# EAGLE design microLift (EAGLE 7.2.0)
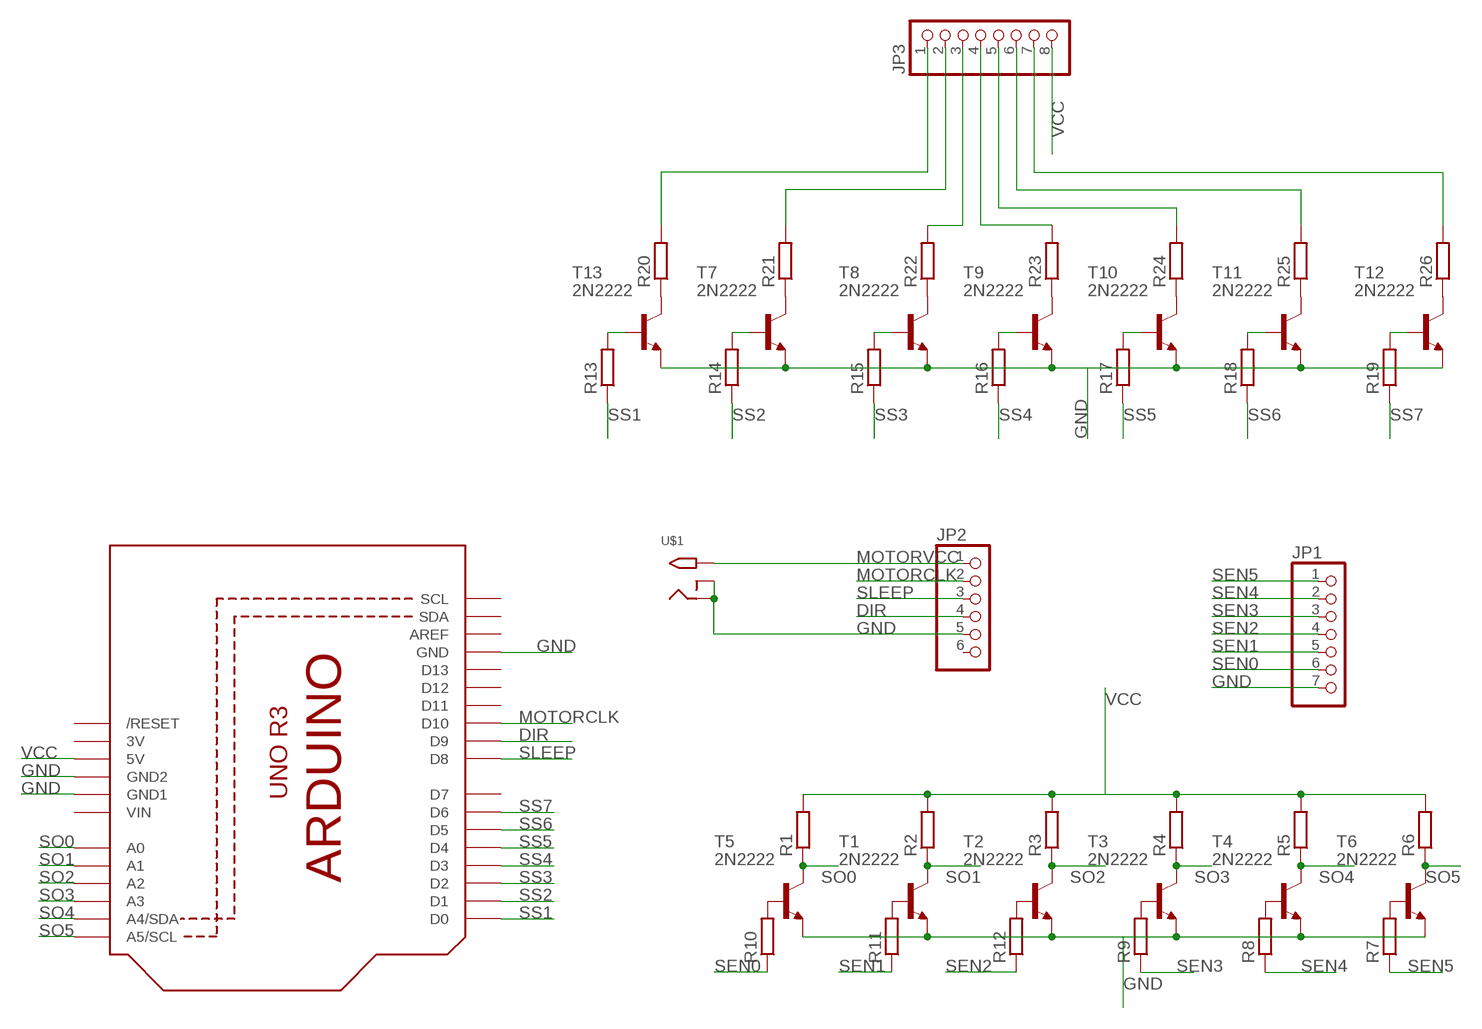
[diagram p0: schematic, sheet 1]

## Parts
JP1  PINHD-1X7  [1X07]
JP2  PINHD-1X6  [1X06]
JP3  PINHD-1X8BIG  [1X08-BIG]
Q1  ARDUINOR3-NOIOREF-NOTEXT  [ARDUINOR3-NOTEXT-NOIOREF]
R1  R-EU_0204/7  [0204/7]
R2  R-EU_0204/7  [0204/7]
R3  R-EU_0204/7  [0204/7]
R4  R-EU_0204/7  [0204/7]
R5  R-EU_0204/7  [0204/7]
R6  R-EU_0204/7  [0204/7]
R7  R-EU_0204/7  [0204/7]
R8  R-EU_0204/7  [0204/7]
R9  R-EU_0204/7  [0204/7]
R10  R-EU_0204/7  [0204/7]
R11  R-EU_0204/7  [0204/7]
R12  R-EU_0204/7  [0204/7]
R13  R-EU_0204/7  [0204/7]
R14  R-EU_0204/7  [0204/7]
R15  R-EU_0204/7  [0204/7]
R16  R-EU_0204/7  [0204/7]
R17  R-EU_0204/7  [0204/7]
R18  R-EU_0204/7  [0204/7]
R19  R-EU_0204/7  [0204/7]
R20  R-EU_0204/7  [0204/7]
R21  R-EU_0204/7  [0204/7]
R22  R-EU_0204/7  [0204/7]
R23  R-EU_0204/7  [0204/7]
R24  R-EU_0204/7  [0204/7]
R25  R-EU_0204/7  [0204/7]
R26  R-EU_0204/7  [0204/7]
T1  2N2222  [TO92-EBC-OVAL]
T2  2N2222  [TO92-EBC-OVAL]
T3  2N2222  [TO92-EBC-OVAL]
T4  2N2222  [TO92-EBC-OVAL]
T5  2N2222  [TO92-EBC-OVAL]
T6  2N2222  [TO92-EBC-OVAL]
T7  2N2222  [TO92-EBC-OVAL]
T8  2N2222  [TO92-EBC-OVAL]
T9  2N2222  [TO92-EBC-OVAL]
T10  2N2222  [TO92-EBC-OVAL]
T11  2N2222  [TO92-EBC-OVAL]
T12  2N2222  [TO92-EBC-OVAL]
T13  2N2222  [TO92-EBC-OVAL]
U$1  2.1MMJACKTHM  [PJ-102A]

## Nets
DIR: JP2.4 Q1.D9
GND: JP1.7 JP2.5 Q1.GND Q1.GND1 Q1.GND2 T1.E T2.E T3.E T4.E T5.E T6.E T7.E T8.E T9.E T10.E T11.E T12.E T13.E U$1.RING U$1.RING_SW
MOTORCLK: JP2.2 Q1.D10
MOTORVCC: JP2.1 U$1.TIP
N$1: R7.2 T6.B
N$2: R8.2 T4.B
N$3: R9.2 T3.B
N$4: R10.2 T5.B
N$5: R11.2 T1.B
N$6: R12.2 T2.B
N$7: R13.2 T13.B
N$8: R14.2 T7.B
N$9: R15.2 T8.B
N$10: R16.2 T9.B
N$11: R17.2 T10.B
N$12: R18.2 T11.B
N$13: R19.2 T12.B
N$14: R20.1 T13.C
N$15: R22.1 T8.C
N$16: R23.1 T9.C
N$17: R25.1 T11.C
N$18: R26.1 T12.C
N$19: R21.1 T7.C
N$20: R24.1 T10.C
N$21: JP3.4 R23.2
N$22: JP3.3 R22.2
N$23: JP3.2 R21.2
N$24: JP3.1 R20.2
N$25: JP3.5 R24.2
N$26: JP3.6 R25.2
N$27: JP3.7 R26.2
SEN0: JP1.6 R10.1
SEN1: JP1.5 R11.1
SEN2: JP1.4 R12.1
SEN3: JP1.3 R9.1
SEN4: JP1.2 R8.1
SEN5: JP1.1 R7.1
SLEEP: JP2.3 Q1.D8
SO0: Q1.A0 R1.1 T5.C
SO1: Q1.A1 R2.1 T1.C
SO2: Q1.A2 R3.1 T2.C
SO3: Q1.A3 R4.1 T3.C
SO4: Q1.A4(A4/SDA) R5.1 T4.C
SO5: Q1.A5(A5/SCL) R6.1 T6.C
SS1: Q1.D0 R13.1
SS2: Q1.D1 R14.1
SS3: Q1.D2 R15.1
SS4: Q1.D3 R16.1
SS5: Q1.D4 R17.1
SS6: Q1.D5 R18.1
SS7: Q1.D6 R19.1
VCC: JP3.8 Q1.5V R1.2 R2.2 R3.2 R4.2 R5.2 R6.2
Unconnected: JP2.6 Q1.AREF Q1.D7 Q1.D11 Q1.D12 Q1.D13 Q1.RESET(/RESET) Q1.SCL Q1.SDA

## Power pins joined to a net without a drawn wire
3V: Q1.3V
VIN: Q1.VIN

## Library data of the parts
JP1 = pinhead:PINHD-1X7: PIN HEADER
JP2 = adafruit:PINHD-1X6: PIN HEADER
JP3 = adafruit:PINHD-1X8: PIN HEADER
Q1 = adafruit:ARDUINOR3-NOIOREF
R1-R6 R13-R26 = rcl:R-EU_: RESISTOR, European symbol
R7-R12 = resistor:R-EU_: RESISTOR, European symbol
T1-T13 = adafruit:2N2222: NPN TRANSISTOR Big oval pads
U$1 = adafruit:2.1MMJACK: 2.1mm x 5.5mm THM DC jack with internal switch. Digikey part #PJ-102A, 4UCON part #05537 2.1mm x 5.5mm SMT DC jack with internal switch. Digikey part #PJ-002A-SMT, 4UCON part #03267 By microbuilder.eu & adafruit.com

## Board
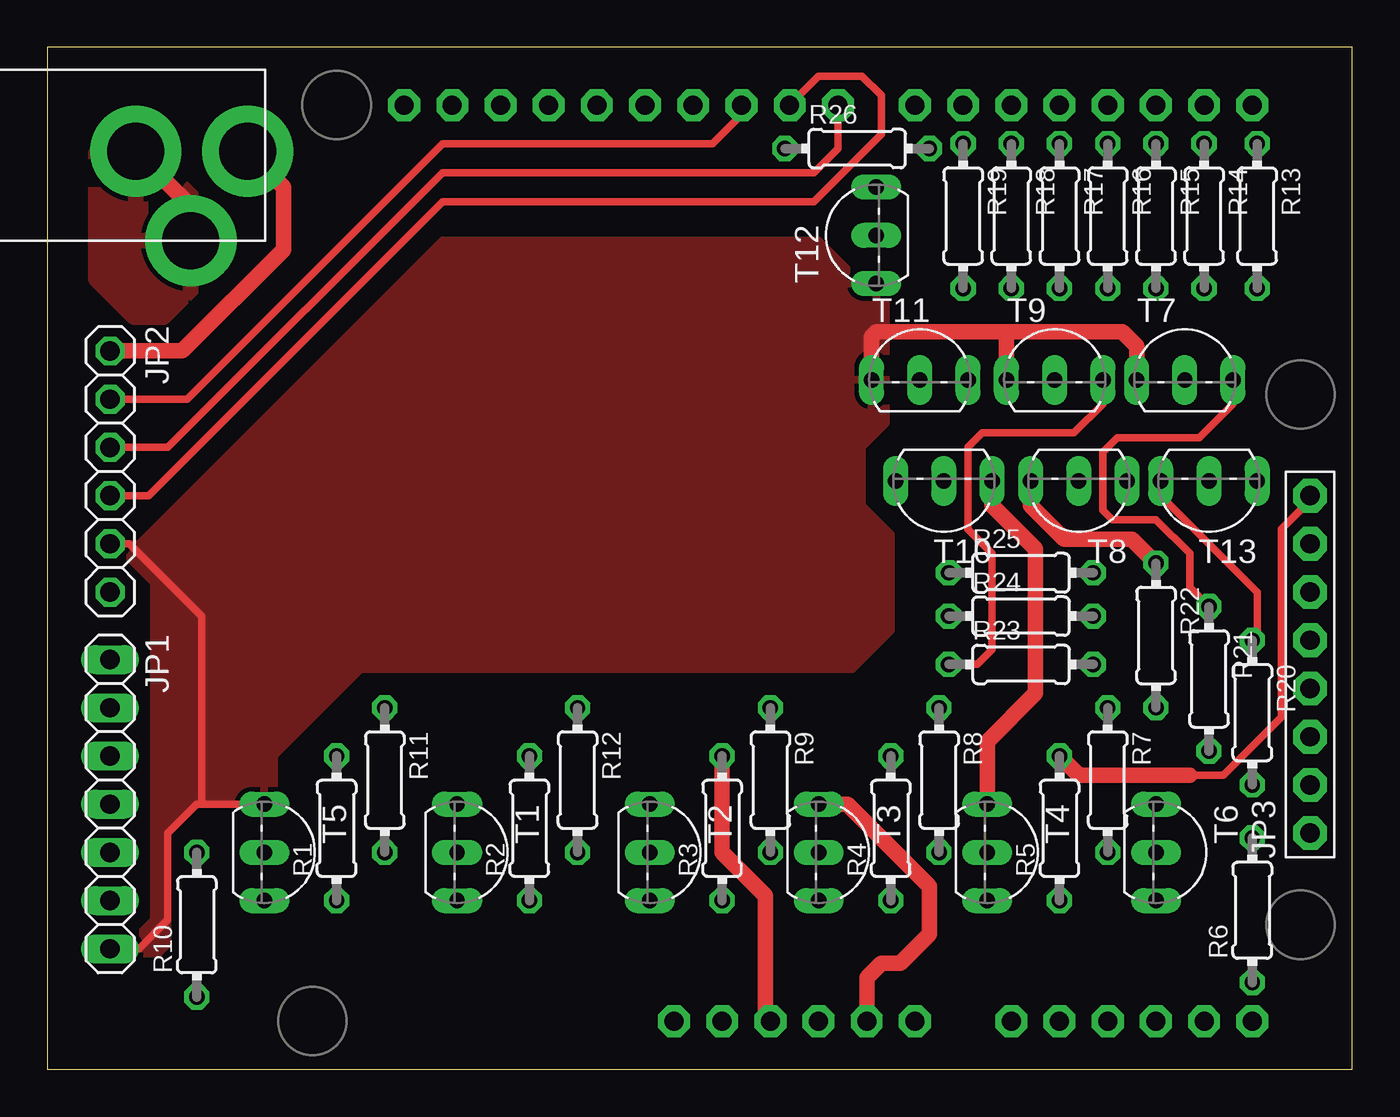
[diagram p1: board, top side]
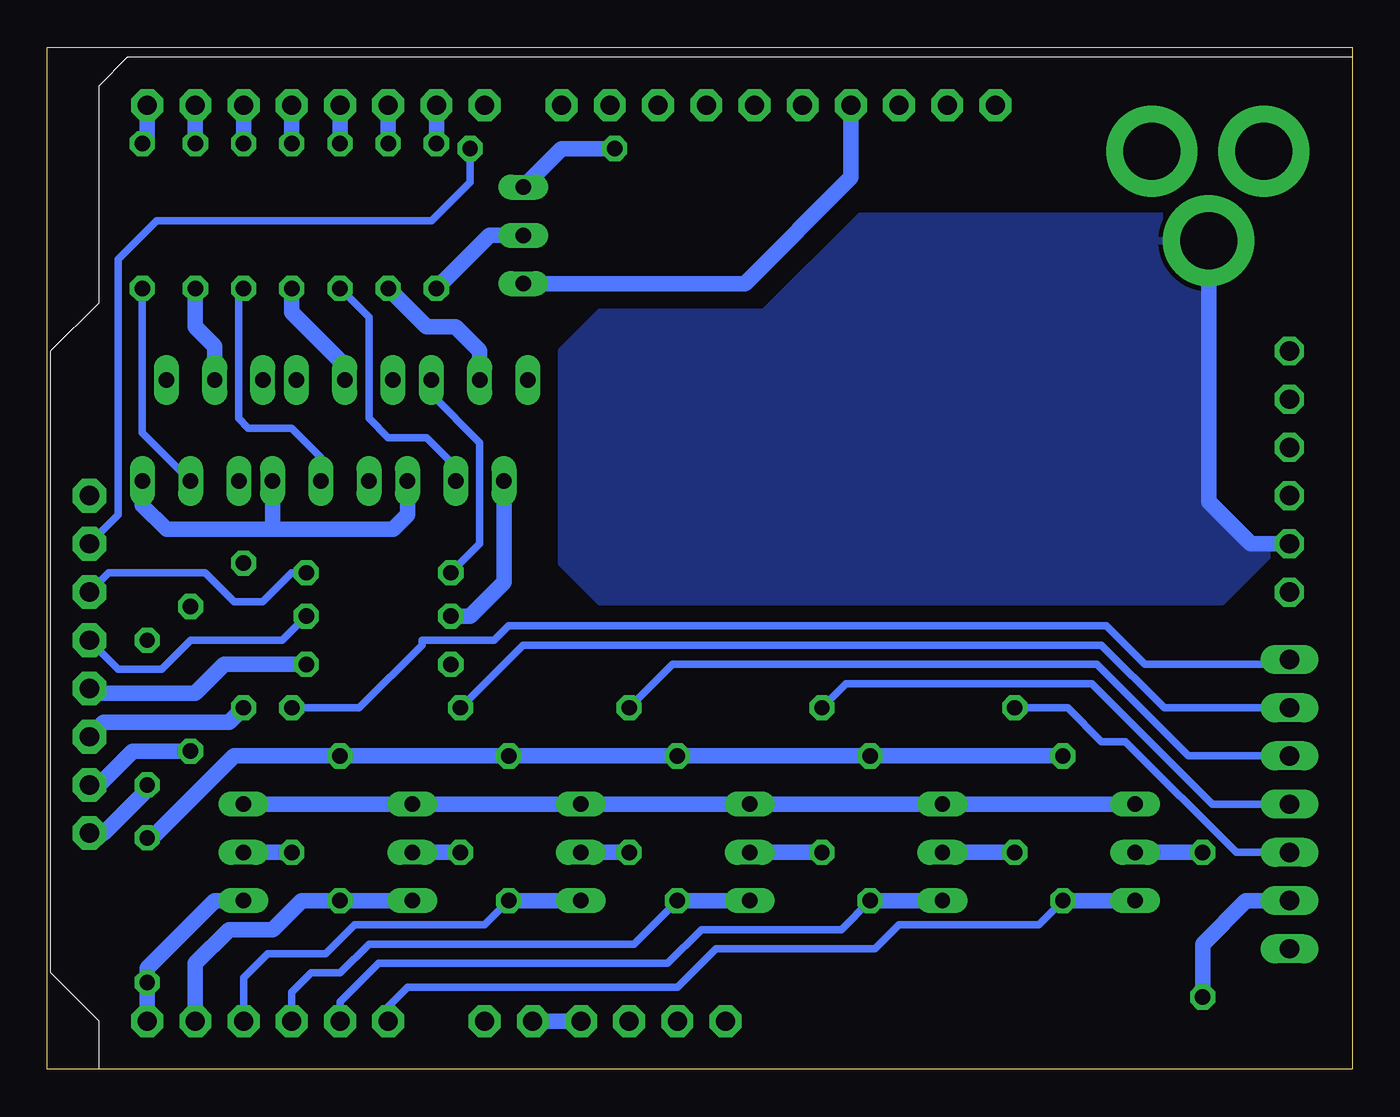
[diagram p2: board, bottom side, seen from below]

Size 68.76 x 53.84 mm. Coordinates in mm from the lower left corner, seen from the top.
Outline: 0,0 68.76,0 68.76,53.84 0,53.84 0,0
Copper layers (1*16): Top 0.035mm / dielectric 1.5mm / Bottom 0.035mm
Design rules "default": minimum track width 10mil, minimum drill 24mil, track to track 8mil, track to pad 8mil, pad to pad 8mil, via to via 8mil, smd to smd 8mil, copper to edge 40mil, drill to drill 8mil, minimum pad ring 10mil, minimum via ring 8mil, stop-mask expansion 4mil, vias tented up to drill 0mil, thermal gap 10mil

### Footprints (pad centres in the part's own frame; a part is rotated, then mirrored left to right if it is on the bottom)
1X07 = drill 1.016 long: 1 -7.62,0; 2 -5.08,0; 3 -2.54,0; 4 0,0; 5 2.54,0; 6 5.08,0; 7 7.62,0
1X06 = drill 1.016 octagon: 1 -6.35,0; 2 -3.81,0; 3 -1.27,0; 4 1.27,0; 5 3.81,0; 6 6.35,0
1X08-BIG = drill 1.016 pad 1.778 octagon: 1 -8.89,0; 2 -6.35,0; 3 -3.81,0; 4 -1.27,0; 5 1.27,0; 6 3.81,0; 7 6.35,0; 8 8.89,0
ARDUINOR3-NOTEXT-NOIOREF = drill 1 pad 1.676 octagon: 3V 35.56,2.54; 5V 38.1,2.54; A0 50.8,2.54; A1 53.34,2.54; A2 55.88,2.54; A3 58.42,2.54; A4 60.96,2.54; A5 63.5,2.54; AREF 23.876,50.8; D0 63.5,50.8; D1 60.96,50.8; D2 58.42,50.8; D3 55.88,50.8; D4 53.34,50.8; D5 50.8,50.8; D6 48.26,50.8; D7 45.72,50.8; D8 41.656,50.8; D9 39.116,50.8; D10 36.576,50.8; D11 34.036,50.8; D12 31.496,50.8; D13 28.956,50.8; GND 26.416,50.8; GND1 43.18,2.54; GND2 40.64,2.54; RESET 33.02,2.54; SCL 18.796,50.8; SDA 21.336,50.8; VIN 45.72,2.54
0204/7 = drill 0.813 octagon: 1 -3.81,0; 2 3.81,0
TO92-EBC-OVAL = drill 0.813 long: B 0,-1.27; C 2.54,-1.27; E -2.54,-1.27
PJ-102A = drill 3 pad 4.8: RING 0.1,-3.39; RING_SW -4.6,-6.29; TIP 0.1,-9.29

### Placement (x,y rotation side)
JP1  3.3,13.97 270 top
JP2  3.3,31.5 270 top
JP3  66.55,21.34 90 top
Q1  0,0 0 top
R1  15.24,12.7 90 top
R2  25.4,12.7 90 top
R3  35.56,12.7 90 top
R4  44.45,12.7 90 top
R5  53.34,12.7 90 top
R6  63.5,8.38 90 top
R7  55.88,15.24 270 top
R8  46.99,15.24 270 top
R9  38.1,15.24 270 top
R10  7.87,7.62 90 top
R11  17.78,15.24 270 top
R12  27.94,15.24 270 top
R13  63.75,44.96 270 top
R14  60.96,44.96 270 top
R15  58.42,44.96 270 top
R16  55.88,44.96 270 top
R17  53.34,44.96 270 top
R18  50.8,44.96 270 top
R19  48.26,44.96 270 top
R20  63.5,18.8 270 top
R21  61.21,20.57 270 top
R22  58.42,22.86 270 top
R23  51.31,21.34 0 top
R24  51.31,23.88 0 top
R25  51.31,26.16 0 top
R26  42.67,48.51 0 top
T1  22.86,11.43 270 top
T2  33.02,11.43 270 top
T3  41.91,11.43 270 top
T4  50.8,11.43 270 top
T5  12.7,11.43 270 top
T6  59.69,11.43 270 top
T7  59.94,37.59 0 top
T8  54.36,29.72 180 top
T9  53.09,37.59 0 top
T10  47.24,29.72 180 top
T11  45.97,37.59 0 top
T12  42.42,43.94 90 top
T13  61.21,29.72 180 top
U$1  1.27,48.26 90 top

### Tracks (layer width: path | path; a pad name or v marks a point on that pad's centre or on a via)
DIR
  Top 0.406: Q1.D9 40.64,52.32 42.93,52.32 43.94,51.31 43.94,49.28 40.39,45.72 20.83,45.72 5.33,30.23 JP2.4
GND
  Top 0.406: JP1.7 4.83,6.35 6.35,7.87 6.35,12.45 7.87,13.97 8.13,13.97 | 8.13,13.97 T5.E | JP2.5 4.32,27.69 8.13,23.88 8.13,13.97
  Top 0.813: T4.E 49.53,17.27 52.07,19.81 52.07,27.43 49.78,29.72 T10.E | U$1.RING_SW 7.56,45.46 U$1.RING | T3.E 42.16,13.97 46.48,9.65 46.48,7.11 44.96,5.59 43.94,5.59 43.18,4.83 Q1.GND1 | T7.E 57.4,38.1 56.64,38.86 50.55,38.86 | 50.55,38.86 43.69,38.86 43.43,38.61 T11.E | T9.E 50.55,38.86
  Bottom 0.813: T6.E T4.E T3.E T2.E T1.E T5.E | T12.E 32,41.4 26.42,46.99 Q1.GND | U$1.RING_SW 7.56,29.91 5.33,27.69 JP2.5 | Q1.GND2 Q1.GND1 | T13.E 63.75,29.72 62.48,28.45 57.15,28.45 | 57.15,28.45 50.55,28.45 49.78,29.21 T10.E | T8.E 56.9,28.7 57.15,28.45
  pour Bottom: 3.56,27.69 5.59,27.69 7.62,29.72 7.62,43.69 7.87,43.94 7.87,44.2 8.64,44.96 25.91,44.96 30.99,39.88 39.62,39.88 41.66,37.85 41.66,26.67 39.62,24.64 6.86,24.64 4.32,27.18 3.56,27.18 3.3,27.43
  pour Top: 3.3,27.69 4.83,27.69 20.83,43.69 40.64,43.69 42.93,41.4 44.2,41.4 44.2,34.04 42.93,32.77 42.93,29.72 44.45,28.19 44.45,23.11 42.42,21.08 16.51,21.08 11.94,16.51 11.94,13.97 8.89,13.97 6.6,16.26 6.6,24.64 3.81,27.43 3.3,27.43
  pour Top: 3.56,6.6 4.32,6.6 5.59,7.87 5.59,27.69 6.1,27.69 8.38,25.4 8.38,14.48 6.35,12.45 6.35,6.6 5.84,6.1 4.06,6.1
  pour Top: 4.57,48.26 2.54,48.26 2.54,41.66 4.57,39.62 6.1,39.62 7.87,41.4 7.87,45.47 7.87,45.72 5.33,48.26
MOTORCLK
  Top 0.406: Q1.D10 36.58,50.29 35.05,48.77 20.83,48.77 7.37,35.31 JP2.2
MOTORVCC
  Top 0.813: JP2.1 7.11,37.85 12.45,43.18 12.45,46.47 U$1.TIP
N$1
  Bottom 0.813: T6.B R7.2
N$2
  Bottom 0.813: T4.B R8.2
N$3
  Bottom 0.813: T3.B R9.2
N$4
  Bottom 0.813: T5.B R10.2
N$5
  Bottom 0.813: R11.2 T1.B
N$6
  Bottom 0.813: R12.2 T2.B
N$7
  Bottom 0.406: R13.2 63.75,33.53 T13.B
N$8
  Bottom 0.813: T7.B 59.94,38.1 60.96,39.12 R14.2
N$9
  Bottom 0.406: R15.2 58.67,41.15 58.67,34.29 58.17,33.78 55.88,33.78 54.36,32.26 T8.B
N$10
  Bottom 0.813: T9.B 53.09,37.08 55.88,39.88 R16.2
N$11
  Bottom 0.406: T10.B 47.24,31.75 48.77,33.27 50.8,33.27 51.82,34.29 51.82,39.62 R17.2
N$12
  Bottom 0.813: T11.B 45.97,37.85 47.24,39.12 48.77,39.12 R18.2
N$13
  Bottom 0.813: T12.B 45.47,43.94 R19.2
N$14
  Top 0.406: T13.C 58.67,30.23 63.75,25.15 63.75,22.86 R20.1
N$15
  Top 0.813: T8.C 51.82,29.72 53.59,27.94 57.15,27.94 R22.1
N$16
  Top 0.406: T9.C 55.63,35.05 54.1,33.53 49.28,33.53 48.51,32.77 48.51,28.45 49.78,27.18 49.78,22.1 49.02,21.34 R23.1
N$17
  Bottom 0.406: T11.C 48.51,35.56 45.97,33.02 45.97,27.69 R25.1
N$18
  Bottom 0.813: R26.1 41.66,48.51 T12.C
N$19
  Top 0.406: T7.C 62.48,35.05 60.71,33.27 56.39,33.27 55.63,32.51 55.63,29.46 56.13,28.96 58.42,28.96 60.2,27.18 60.2,25.4 R21.1
N$20
  Bottom 0.813: R24.1 46.48,23.88 44.7,25.65 T10.C
N$21
  Bottom 0.813: R23.2 59.44,21.34 60.96,19.81 66.29,19.81 JP3.4
N$22
  Bottom 0.813: R22.2 59.18,18.29 65.79,18.29 JP3.3
N$23
  Bottom 0.813: JP3.2 66.04,14.99 64.26,16.76 R21.2
N$24
  Bottom 0.813: R20.2 63.5,14.73 65.79,12.45 JP3.1
N$25
  Bottom 0.406: JP3.5 65.02,21.08 62.74,21.08 61.21,22.61 56.39,22.61 R24.2
N$26
  Bottom 0.406: R25.2 55.88,26.16 57.4,24.64 58.93,24.64 60.45,26.16 65.53,26.16 JP3.6
N$27
  Bottom 0.406: R26.2 46.48,46.74 48.51,44.7 62.99,44.7 65.02,42.67 65.02,29.21 JP3.7
SEN0
  Bottom 0.813: JP1.6 5.59,8.89 7.87,6.6 R10.1
SEN1
  Bottom 0.406: JP1.5 6.1,11.43 11.94,17.27 13.21,17.27 14.99,19.05 R11.1
SEN2
  Bottom 0.406: JP1.4 7.37,13.97 13.72,20.32 26.67,20.32 R12.1
SEN3
  Bottom 0.406: JP1.3 8.64,16.51 13.46,21.34 35.81,21.34 R9.1
SEN4
  Bottom 0.406: JP1.2 9.91,19.05 13.21,22.35 43.69,22.35 R8.1
SEN5
  Bottom 0.406: R7.1 52.32,19.05 49.02,22.35 49.02,22.61 45.21,22.61 44.45,23.37 12.95,23.37 10.92,21.34 3.56,21.34 JP1.1
SLEEP
  Top 0.406: JP2.3 6.35,32.77 20.83,47.24 40.39,47.24 41.66,48.51 Q1.D8
SO0
  Bottom 0.406: Q1.A0 50.8,3.3 49.78,4.32 35.56,4.32 33.53,6.35 25.15,6.35 23.88,7.62 16.51,7.62 R1.1
  Bottom 0.813: R1.1 T5.C
SO1
  Bottom 0.406: Q1.A1 53.34,3.56 51.31,5.59 36.07,5.59 34.29,7.37 26.92,7.37 R2.1
  Bottom 0.813: T1.C R2.1
SO2
  Bottom 0.406: Q1.A2 55.88,4.06 54.86,5.08 53.34,5.08 51.82,6.6 37.85,6.6 R3.1
  Bottom 0.813: R3.1 T2.C
SO3
  Bottom 0.406: Q1.A3 58.42,4.83 57.15,6.1 54.1,6.1 52.58,7.62 45.72,7.62 R4.1
  Bottom 0.813: R4.1 T3.C
SO4
  Bottom 0.813: T4.C R5.1 55.37,8.89 56.9,7.37 59.18,7.37 60.96,5.59 Q1.A4
SO5
  Bottom 0.813: T6.C 59.94,8.89 63.5,5.33 R6.1 Q1.A5
SS1
  Bottom 0.813: Q1.D0 63.5,49.02 R13.1
SS2
  Bottom 0.813: Q1.D1 R14.1
SS3
  Bottom 0.813: Q1.D2 R15.1
SS4
  Bottom 0.813: Q1.D3 R16.1
SS5
  Bottom 0.813: Q1.D4 R17.1
SS6
  Bottom 0.813: Q1.D5 R18.1
SS7
  Bottom 0.813: Q1.D6 R19.1
VCC
  Top 0.406: JP3.8 66.55,29.97 65.02,28.45 65.02,18.54 61.98,15.49 60.2,15.49
  Top 0.813: R3.2 35.56,11.43 37.85,9.14 37.85,2.79 Q1.5V | R5.2 54.36,15.49 60.2,15.49
  Bottom 0.813: R3.2 R2.2 R1.2 R4.2 R5.2 58.93,16.51 63.25,12.19 R6.2